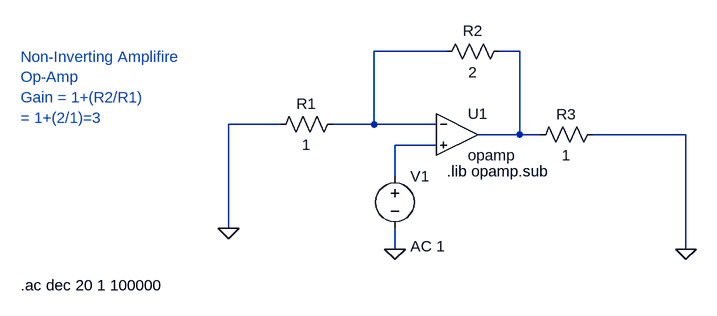
[diagram p0: schematic NonInvertingAmplifire.asc]
NonInvertingAmplifire.asc, the LTspice schematic file:
Version 4.1
SHEET 1 900 680
WIRE 512 -32 400 -32
WIRE 624 -32 592 -32
WIRE 256 80 176 80
WIRE 400 80 400 -32
WIRE 400 80 336 80
WIRE 496 80 400 80
WIRE 624 96 624 -32
WIRE 624 96 560 96
WIRE 656 96 624 96
WIRE 880 96 736 96
WIRE 496 112 432 112
WIRE 432 160 432 112
WIRE 176 240 176 80
WIRE 432 272 432 240
WIRE 880 272 880 96
FLAG 176 240 0
FLAG 432 272 0
FLAG 880 272 0
SYMBOL res 352 64 R90
WINDOW 0 0 56 VBottom 2
WINDOW 3 32 56 VTop 2
SYMATTR InstName R1
SYMATTR Value 1
SYMBOL res 608 -48 R90
WINDOW 0 0 56 VBottom 2
WINDOW 3 32 56 VTop 2
SYMATTR InstName R2
SYMATTR Value 2
SYMBOL OpAmps\\opamp 528 32 R0
SYMATTR InstName U1
SYMBOL res 752 80 R90
WINDOW 0 0 56 VBottom 2
WINDOW 3 32 56 VTop 2
SYMATTR InstName R3
SYMATTR Value 1
SYMBOL voltage 432 144 R0
WINDOW 123 24 124 Left 2
WINDOW 39 0 0 Left 0
SYMATTR InstName V1
SYMATTR Value ""
SYMATTR Value2 AC 1
TEXT -144 -24 Left 2 ;Non-Inverting Amplifire\nOp-Amp\nGain = 1+(R2/R1)\n= 1+(2/1)=3
TEXT 512 152 Left 2 !.lib opamp.sub
TEXT -144 328 Left 2 !.ac dec 20 1 100000

The netlist it stands for:
* NonInvertingAmplifire.asc
R1 N001 0 1
R2 N002 N001 2
X§U1 N001 N003 N002 opamp Aol=100K GBW=10Meg  ; pins invin noninvin out
R3 0 N002 1
V1 N003 0 AC 1
* Non-Inverting Amplifire
* Op-Amp
* Gain = 1+(R2/R1)
* = 1+(2/1)=3
.lib opamp.sub
.ac dec 20 1 100000
.backanno
.end